# EAGLE design l293_board (EAGLE 7.1.0)
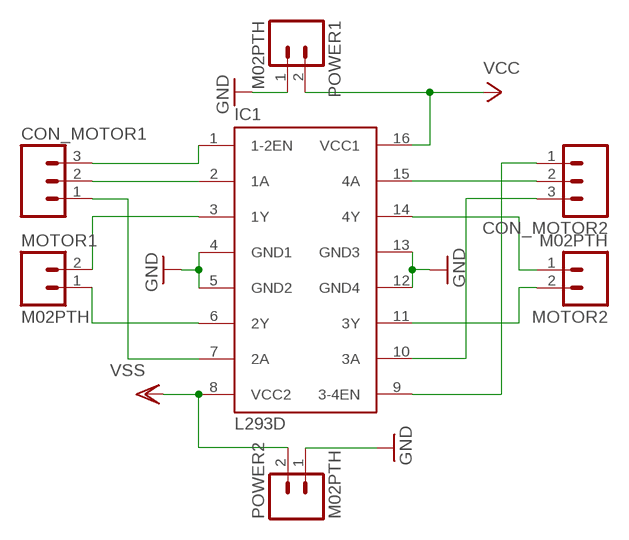
[diagram p0: schematic, sheet 1]

## Parts
CON_MOTOR1  M03PTH  [1X03]
CON_MOTOR2  M03PTH  [1X03]
IC1  L293D  [DIL16]
MOTOR1  M02PTH  [1X02]
MOTOR2  M02PTH  [1X02]
POWER1  M02PTH  [1X02]
POWER2  M02PTH  [1X02]

## Nets
GND: IC1.4(GND1) IC1.5(GND2) IC1.12(GND4) IC1.13(GND3) POWER1.1 POWER2.1
N$1: CON_MOTOR2.1 IC1.9(3-4EN)
N$2: CON_MOTOR1.3 IC1.1(1-2EN)
N$3: IC1.3(1Y) MOTOR1.2
N$4: IC1.6(2Y) MOTOR1.1
N$5: CON_MOTOR2.2 IC1.15(4A)
N$6: CON_MOTOR1.2 IC1.2(1A)
N$7: CON_MOTOR1.1 IC1.7(2A)
N$9: IC1.14(4Y) MOTOR2.1
N$10: IC1.11(3Y) MOTOR2.2
N$11: CON_MOTOR2.3 IC1.10(3A)
VCC: IC1.16(VCC1) POWER1.2
VSS: IC1.8(VCC2) POWER2.2

## Library data of the parts
CON_MOTOR1 CON_MOTOR2 = SparkFun-Connectors:M03: Header 3 Standard 3-pin 0.1" header. Use with straight break away headers (SKU : PRT-00116), right angle break away headers (PRT-00553), swiss pins (PRT-00743), machine pins (PRT-00117), and female headers (PRT-00115). Molex polarized connector foot print use with SKU : PRT-08232 with associated crimp pins and housings.
IC1 = st-microelectronics:L293D: PUSH-PULL 4 CHANNEL DRIVER; MPN: L293D; OC_FARNELL: 9589619; OC_NEWARK: 56P8249
MOTOR1 MOTOR2 POWER1 POWER2 = SparkFun-Connectors:M02: Standard 2-pin 0.1" header. Use with - straight break away headers ( PRT-00116) - right angle break away headers (PRT-00553) - swiss pins (PRT-00743) - machine pins (PRT-00117) - female headers (PRT-00115) Molex polarized connector foot print use with: PRT-08233 with associated crimp pins and housings. 2.54_SCREWTERM for use with PRT-10571. 3.5mm Screw Terminal footprints for PRT-08084 5mm Screw Terminal footprints for use with PRT-08432

## Board
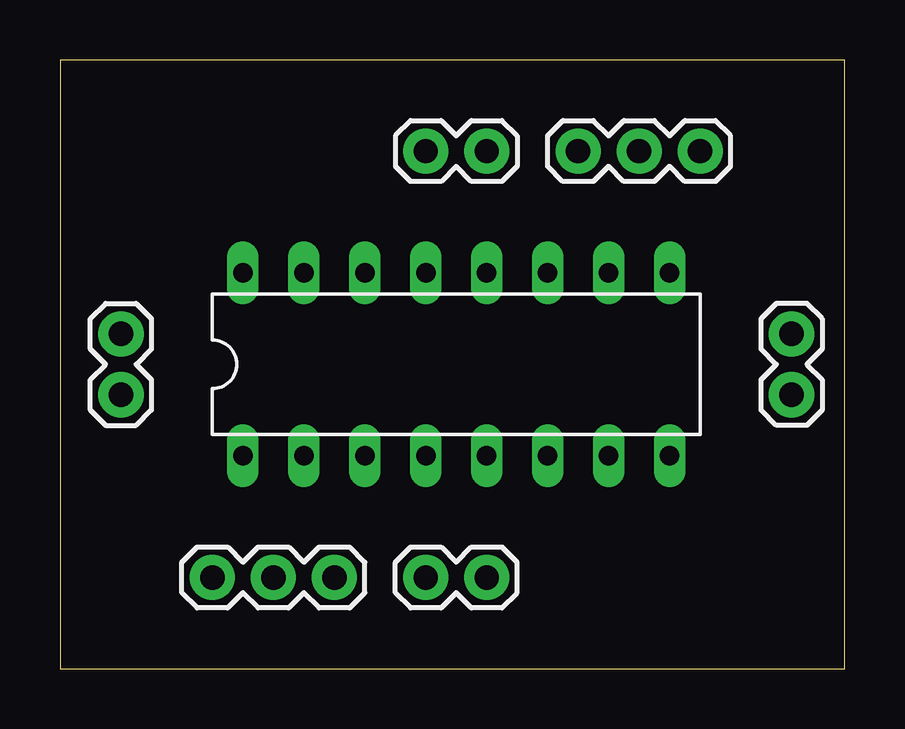
[diagram p1: board, top side]
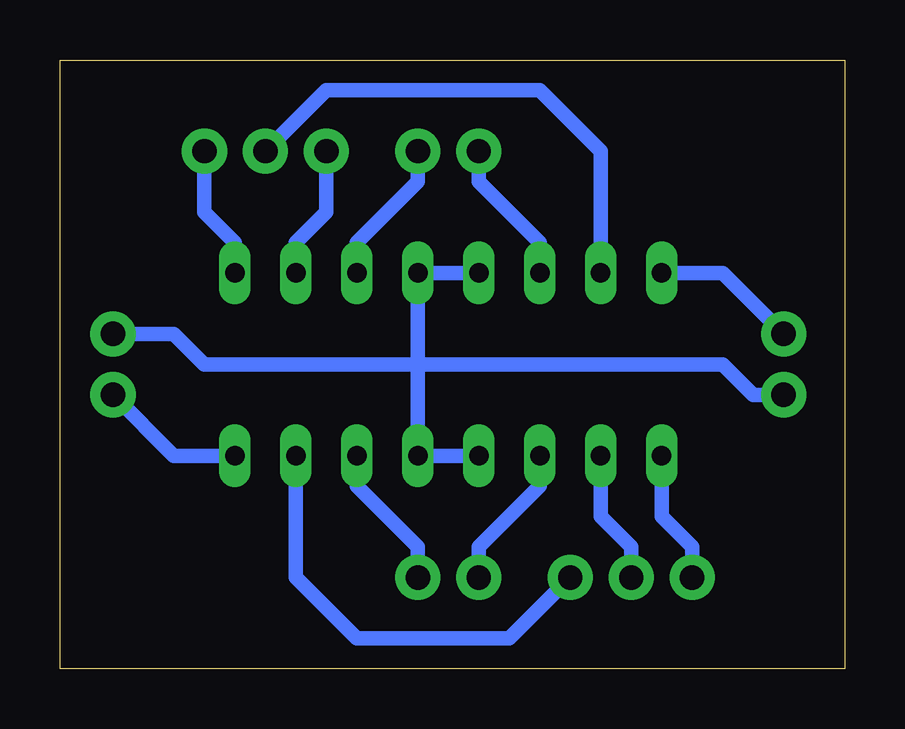
[diagram p2: board, bottom side, seen from below]

Size 32.69 x 25.39 mm. Coordinates in mm from the lower left corner, seen from the top.
Outline: 0,0 32.69,0 32.69,25.39 0,25.39 0,0
Copper layers (1*16): Top 0.035mm / dielectric 1.5mm / Bottom 0.035mm
Design rules "default": minimum track width 10mil, minimum drill 24mil, track to track 8mil, track to pad 8mil, pad to pad 8mil, via to via 8mil, smd to smd 8mil, copper to edge 40mil, drill to drill 8mil, minimum pad ring 10mil, minimum via ring 8mil, stop-mask expansion 4mil, vias tented up to drill 0mil, thermal gap 10mil

### Footprints (pad centres in the part's own frame; a part is rotated, then mirrored left to right if it is on the bottom)
1X03 = drill 1.016 pad 1.88: 1 0,0; 2 2.54,0; 3 5.08,0
DIL16 = drill 0.813 long: 1 -8.89,-3.81; 2 -6.35,-3.81; 3 -3.81,-3.81; 4 -1.27,-3.81; 5 1.27,-3.81; 6 3.81,-3.81; 7 6.35,-3.81; 8 8.89,-3.81; 9 8.89,3.81; 10 6.35,3.81; 11 3.81,3.81; 12 1.27,3.81; 13 -1.27,3.81; 14 -3.81,3.81; 15 -6.35,3.81; 16 -8.89,3.81
1X02 = drill 1.016 pad 1.88: 1 0,0; 2 2.54,0

### Placement (x,y rotation side)
CON_MOTOR1  11.43,3.81 180 top
CON_MOTOR2  26.67,21.59 180 top
IC1  16.51,12.7 0 top
MOTOR1  17.78,3.81 180 top
MOTOR2  15.24,21.59 0 top
POWER1  2.54,11.43 90 top
POWER2  30.48,13.97 270 top

### Tracks (layer width: path | path; a pad name or v marks a point on that pad's centre or on a via)
GND
  Bottom 0.61: IC1.4 IC1.5 17.78,12.7 | 17.78,12.7 IC1.12 IC1.13 | POWER1.1 3.81,11.43 5.08,12.7 17.78,12.7 | 17.78,12.7 26.67,12.7 27.94,13.97 POWER2.1
N$1
  Bottom 0.61: CON_MOTOR2.1 26.67,19.05 25.4,17.78 IC1.9
N$2
  Bottom 0.61: CON_MOTOR1.3 6.35,5.08 7.62,6.35 IC1.1
N$3
  Bottom 0.61: IC1.3 12.7,7.62 15.24,5.08 MOTOR1.2
N$4
  Bottom 0.61: IC1.6 20.32,7.62 17.78,5.08 MOTOR1.1
N$5
  Bottom 0.61: IC1.15 10.16,21.59 12.7,24.13 21.59,24.13 CON_MOTOR2.2
N$6
  Bottom 0.61: CON_MOTOR1.2 8.89,5.08 10.16,6.35 IC1.2
N$7
  Bottom 0.61: CON_MOTOR1.1 13.97,1.27 20.32,1.27 22.86,3.81 IC1.7
N$9
  Bottom 0.61: IC1.14 12.7,17.78 15.24,20.32 MOTOR2.1
N$10
  Bottom 0.61: MOTOR2.2 17.78,20.32 20.32,17.78 IC1.11
N$11
  Bottom 0.61: CON_MOTOR2.3 21.59,19.05 22.86,17.78 IC1.10
VCC
  Bottom 0.61: POWER1.2 5.08,16.51 IC1.16
VSS
  Bottom 0.61: IC1.8 27.94,8.89 POWER2.2